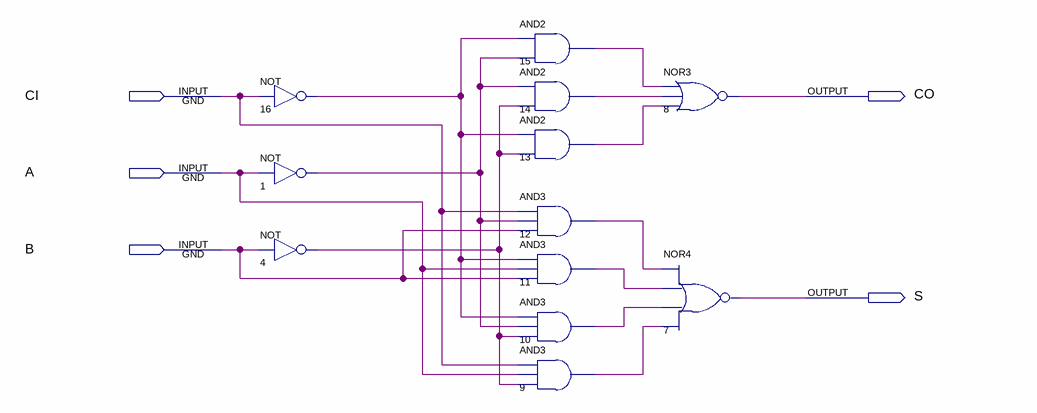
[diagram p0: schematic sheet]
// Quartus schematic 1-bit-adder.bdf as structural Verilog: 12 symbols, 5 pins
module \1-bit-adder  (
  input  CI,
  input  A,
  input  B,
  output CO,
  output S
);

  wire n1_out, n4_out, n9_out, n10_out, n11_out, n12_out, n13_out, n14_out, n15_out, n16_out;

  not u_16 (n16_out, CI);
  not u_1 (n1_out, A);
  not u_4 (n4_out, B);
  and u_15 (n15_out, n16_out, n1_out);
  and u_14 (n14_out, n1_out, n4_out);
  and u_13 (n13_out, n16_out, n4_out);
  and u_12 (n12_out, CI, n1_out, B);
  and u_11 (n11_out, n16_out, A, B);
  and u_10 (n10_out, n16_out, n1_out, n4_out);
  and u_9 (n9_out, CI, A, n4_out);
  nor u_8 (CO, n15_out, n14_out, n13_out);
  nor u_7 (S, n12_out, n11_out, n10_out, n9_out);
endmodule
